# EAGLE schematic roboproj q2 (EAGLE 9.6.2)
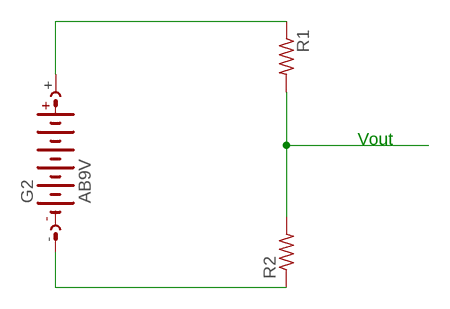
[diagram p0: schematic, sheet 1]

## Parts
G2  AB9V  [AB9V]
R1  R-US_R0805  [R0805]
R2  R-US_R0805  [R0805]

## Nets
N$1: G2.+ R1.1
N$2: R1.2 R2.2
N$3: G2.- R2.1

## Notes on the sheet
- Vout

## Library data of the parts
G2 = battery:AB9V: 9-V BATTERY CLIP
R1 R2 = rcl:R-US_: RESISTOR, American symbol; SPICEPREFIX: R